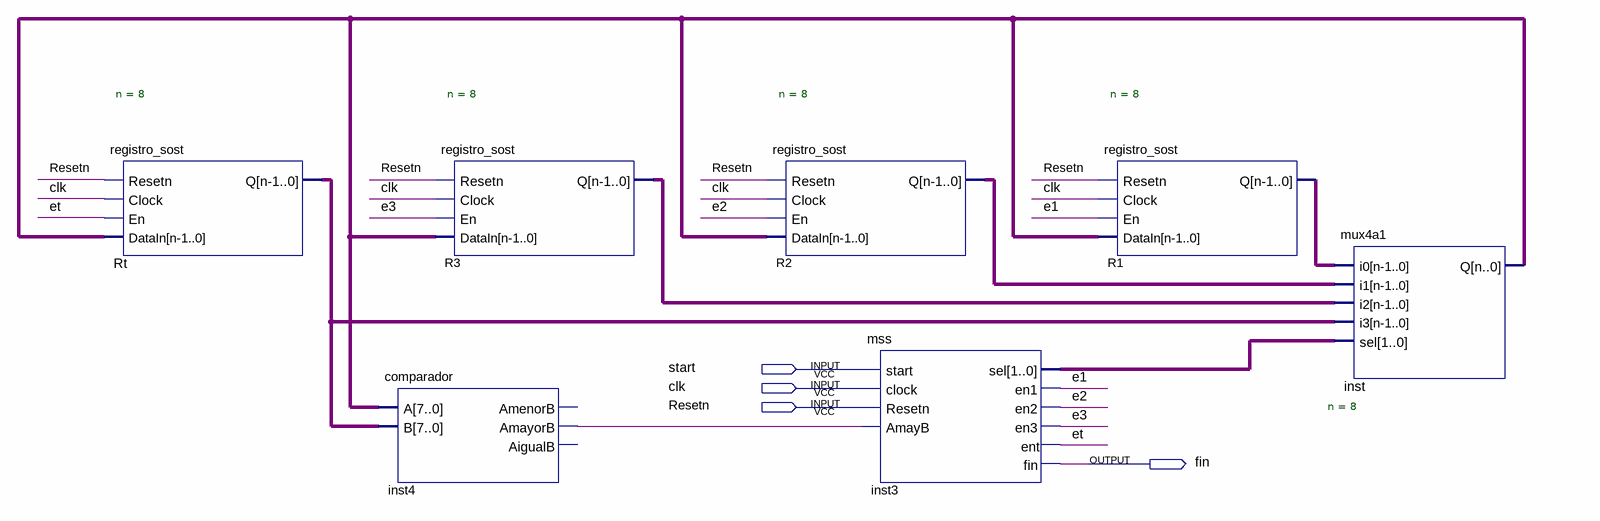
[diagram p0: schematic sheet]
// Quartus schematic OrdenarRegistros.bdf as structural Verilog: 7 symbols, 4 pins
module OrdenarRegistros (
  input  start,
  input  clk,
  input  Resetn,
  output fin
);

  wire e1, e2, e3, et, inst4_amayorb;
  wire [1:0] inst3_sel;
  wire [7:0] R1_q, R2_q, R3_q, Rt_q;
  wire [8:0] inst_q;

  registro_sost #(.n(8)) Rt (.Resetn(Resetn), .Clock(clk), .En(et), .DataIn(inst_q), .Q(Rt_q));
  comparador inst4 (.A(inst_q), .B(Rt_q), .AmayorB(inst4_amayorb));  // open: AmenorB, AigualB
  registro_sost #(.n(8)) R3 (.Resetn(Resetn), .Clock(clk), .En(e3), .DataIn(inst_q), .Q(R3_q));
  registro_sost #(.n(8)) R2 (.Resetn(Resetn), .Clock(clk), .En(e2), .DataIn(inst_q), .Q(R2_q));
  mss inst3 (
    .start(start), .clock(clk), .Resetn(Resetn), .AmayB(inst4_amayorb), .sel(inst3_sel), .en1(e1), .en2(e2),
    .en3(e3), .ent(et), .fin(fin));
  registro_sost #(.n(8)) R1 (.Resetn(Resetn), .Clock(clk), .En(e1), .DataIn(inst_q), .Q(R1_q));
  mux4a1 #(.n(8)) inst (.i0(R1_q), .i1(R2_q), .i2(R3_q), .i3(Rt_q), .sel(inst3_sel), .Q(inst_q));
endmodule
